# Altium project RpiRackHat.PrjPcb
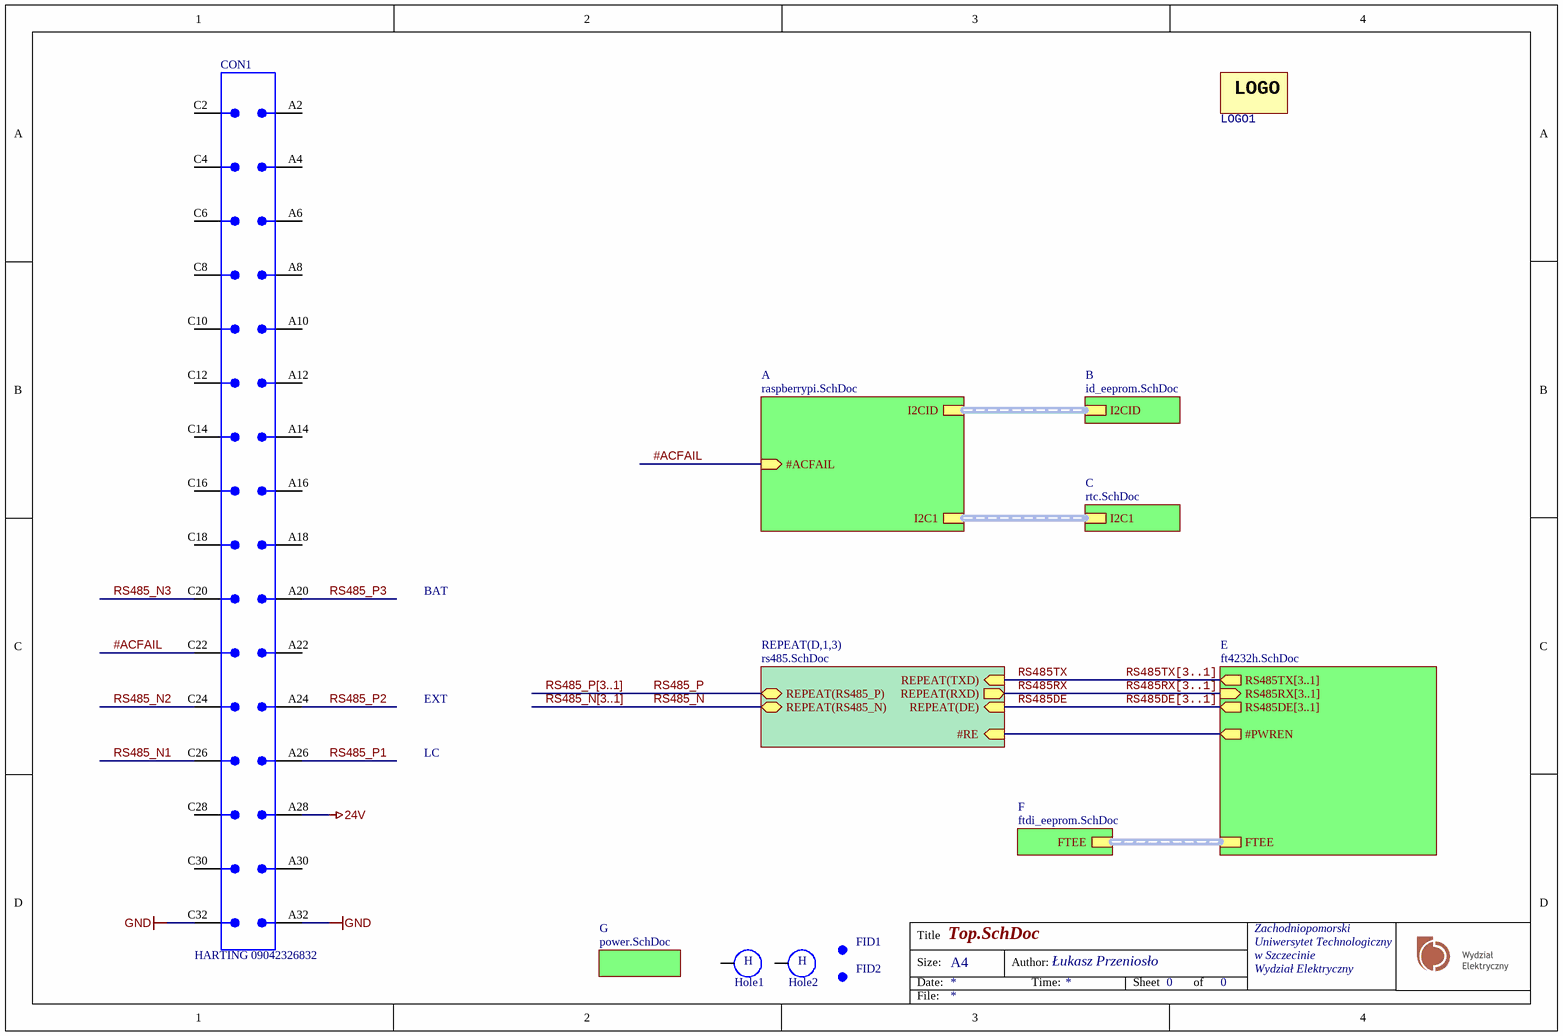
[diagram p0: Top.SchDoc]
id: RpiRackHat; ver: 1.0
8 sheets, 106 parts. Net scope: hierarchical (ports join the sheet entries above them; power ports are global).
Board file: RpiRackHat.PcbDoc
Sheets:
  Top.SchDoc
    E = ft4232h.SchDoc
    B = id_eeprom.SchDoc
    D1 = rs485.SchDoc
    D2 = rs485.SchDoc
    D3 = rs485.SchDoc
    C = rtc.SchDoc
    A = raspberrypi.SchDoc
    G = power.SchDoc
    F = ftdi_eeprom.SchDoc

## Sheet Top.SchDoc: Test
size A4; DrawnBy: Łukasz Przeniosło; Organization: Zachodniopomorski; Address1: Uniwersytet Technologiczny; Address2: w Szczecinie; Address3: Wydział Elektryczny; DocumentNumber: 1111; Revision: 1.0; SheetNumber: 0; SheetTotal: 0

### Parts
CON1  HARTING 09042326832  [HARTING 09041326921]
FID1  Fiducial  [Fid Round]  (value not drawn)  (no BOM)
FID2  Fiducial  [Fid Round]  (value not drawn)  (no BOM)
Hole1  Hole  [Hole-3/6]  (value not drawn)
Hole2  Hole  [Hole-3/6]  (value not drawn)
LOGO1  Logo  [LOGO_BEMKO]  (value not drawn)

### Sub-sheets
A = raspberrypi.SchDoc: I2CID (harness I2CID), I2C1 (harness I2C1), #ACFAIL (in)
B = id_eeprom.SchDoc: I2CID (harness I2CID)
C = rtc.SchDoc: I2C1 (harness I2C1)
E = ft4232h.SchDoc: #PWREN (out), FTEE (harness FTEE), RS485DE[3..1] (out), RS485RX[3..1] (in), RS485TX[3..1] (out)
F = ftdi_eeprom.SchDoc: FTEE (harness FTEE)
G = power.SchDoc: no entries
REPEAT(D,1,3) = rs485.SchDoc: REPEAT(TXD) (in), REPEAT(RXD) (out), REPEAT(DE) (in), #RE (in), REPEAT(RS485_N) (bidir), REPEAT(RS485_P) (bidir)

### Nets
24V: CON1.A28
GND: CON1.A32 CON1.C32
#ACFAIL: CON1.C22 ; sheet A/#ACFAIL
#PWREN: sheet E/#PWREN, sheet REPEAT(D,1,3)/#RE
RS485_N: sheet REPEAT(D,1,3)/REPEAT(RS485_N)
RS485_N1: CON1.C26
RS485_N2: CON1.C24
RS485_N3: CON1.C20
RS485_P: sheet REPEAT(D,1,3)/REPEAT(RS485_P)
RS485_P1: CON1.A26
RS485_P2: CON1.A24
RS485_P3: CON1.A20
RS485DE: sheet REPEAT(D,1,3)/REPEAT(DE)
RS485RX: sheet REPEAT(D,1,3)/REPEAT(RXD)
RS485TX: sheet REPEAT(D,1,3)/REPEAT(TXD)

Not connected (* = marked no-connect by the designer): CON1 A2 A4 A6 A8 A10 A12 A14 A16 A18 A22 A30 C2 C4 C6 C8 C10 C12 C14 C16 C18 C28 C30; Hole1 1; Hole2 1

### Buses and harness runs
bus RS485_N[3..1]
bus RS485_P[3..1]
bus RS485DE[3..1] = sheet E/RS485DE[3..1]
bus RS485RX[3..1] = sheet E/RS485RX[3..1]
bus RS485TX[3..1] = sheet E/RS485TX[3..1]
harness sheet A/I2C1 = sheet C/I2C1
harness sheet A/I2CID = sheet B/I2CID
harness sheet E/FTEE = sheet F/FTEE

### Notes on the sheet
- BAT
- EXT
- LC
- Title
- Size:
- Date:
- A4
- Author:
- Time:
- Sheet
- of
- File:
- (in symbol HOLE_) H
- (in symbol Logo) LOGO

### Library data of the parts
CON1 = HARTING_09042326832: Board-to-Board Connector, Eurocard VME, Vertical, 3-Row, 32-Position,
FID1 FID2 = FID ROUND: round fiducial
Hole1 Hole2 = HOLE_

## Sheet ft4232h.SchDoc: Test
size A4; DrawnBy: Łukasz Przeniosło; Organization: Zachodniopomorski; Address1: Uniwersytet Technologiczny; Address2: w Szczecinie; Address3: Wydział Elektryczny; DocumentNumber: 4; Revision: 1.0; SheetNumber: 4; SheetTotal: 8
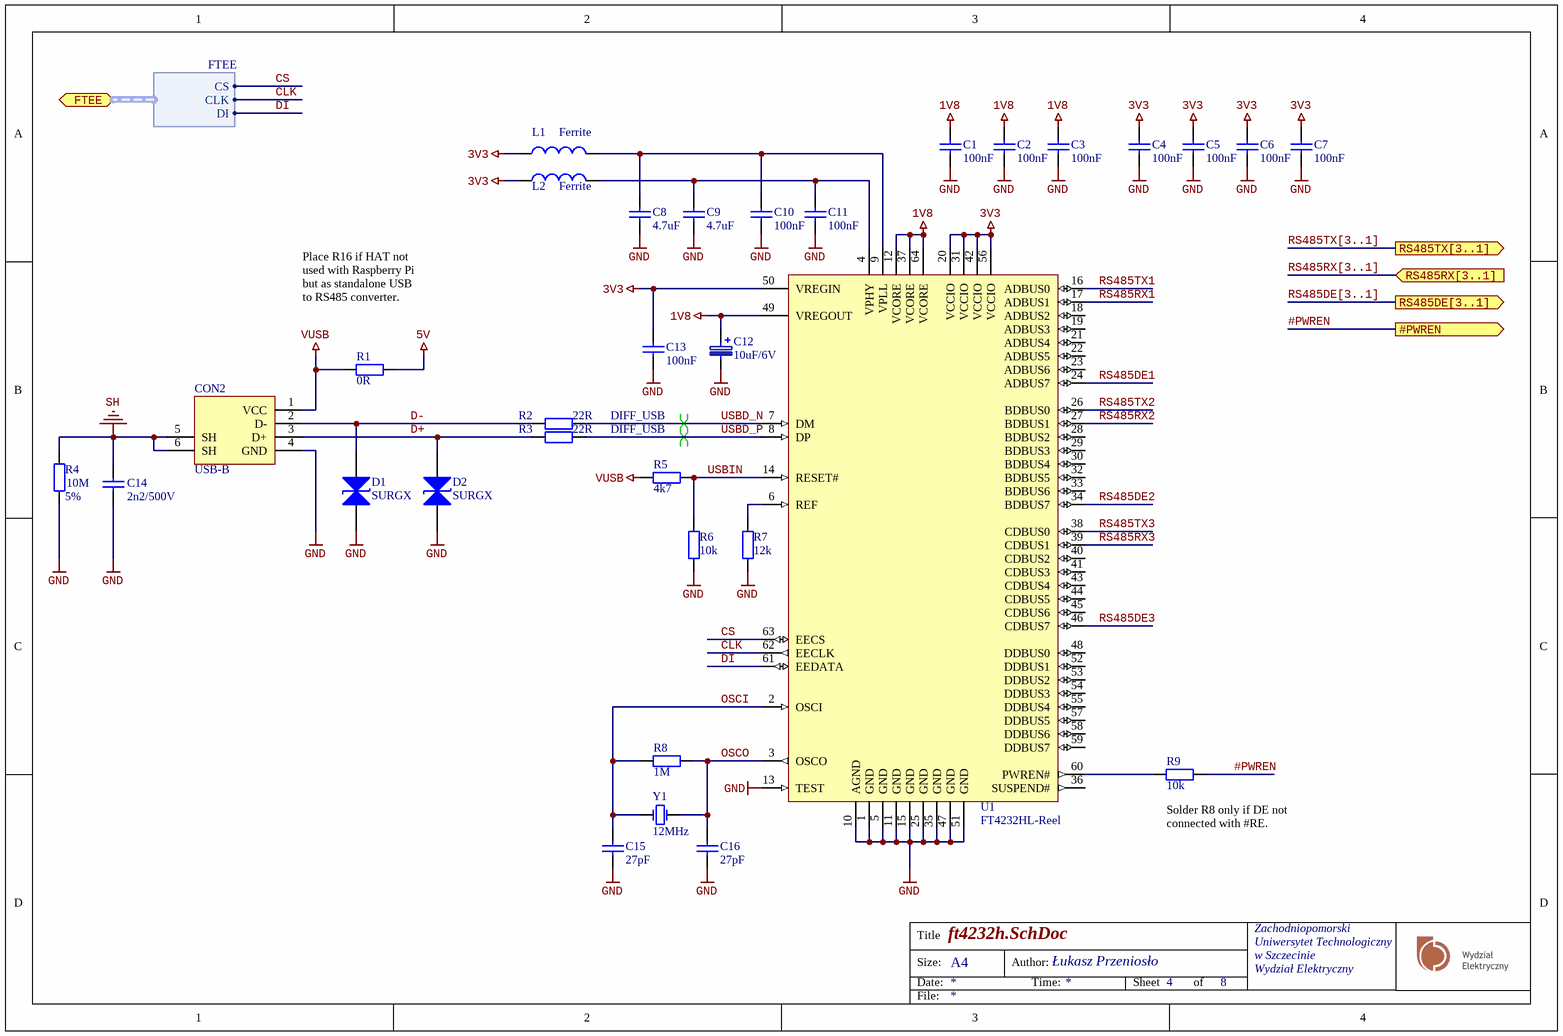
[diagram p1: ft4232h.SchDoc]

### Parts
C1  100nF  [CAPC1608N]
C2  100nF  [CAPC1608N]
C3  100nF  [CAPC1608N]
C4  100nF  [CAPC1608N]
C5  100nF  [CAPC1608N]
C6  100nF  [CAPC1608N]
C7  100nF  [CAPC1608N]
C8  4.7uF  [CAPC1608N]
C9  4.7uF  [CAPC1608N]
C10  100nF  [CAPC1608N]
C11  100nF  [CAPC1608N]
C12  10uF/6V  [SMDA]
C13  100nF  [CAPC1608N]
C14  2n2/500V  [CAPC3216N]
C15  27pF  [CAPC1608N]
C16  27pF  [CAPC1608N]
CON2  USB-B  [USB-B-STRAIGHT]
D1  SURGX  [SURGX-0603]
D2  SURGX  [SURGX-0603]
L1  Ferrite  [inductor_0603]
L2  Ferrite  [inductor_0603]
R1  0R  [RESC2012N]
R2  22R  [RESC1608N]
R3  22R  [RESC1608N]
R4  Tolerance: 5%  [RESC3216N]  (hidden comment: 10M)
R5  4k7  [RESC1608N]
R6  10k  [RESC1608N]
R7  12k  [RESC1608N]
R8  1M  [RESC1608N]
R9  10k  [RESC1608N]
U1  FT4232HL-Reel  [LQFP-64_L]
Y1  12MHz  [HC49/4H_SMX]

### Ports
#PWREN (out), FTEE (harness FTEE), RS485DE[3..1] (out), RS485RX[3..1] (in), RS485TX[3..1] (out)

### Harnesses
FTEE: CS, CLK, DI

### Nets
1V8: C1.1 C2.1 C3.1 C12.1 U1.12(VCORE) U1.37(VCORE) U1.49(VREGOUT) U1.64(VCORE)
3V3: C4.1 C5.1 C6.1 C7.1 C13.1 L1.1 L2.1 U1.20(VCCIO) U1.31(VCCIO) U1.42(VCCIO) U1.50(VREGIN) U1.56(VCCIO)
5V: R1.1
GND: C1.2 C2.2 C3.2 C4.2 C5.2 C6.2 C7.2 C8.2 C9.2 C10.2 C11.2 C12.2 C13.2 C14.1 C15.1 C16.1 CON2.4(GND) D1.1 D2.1 R4.1 R6.2 R7.2 U1.1(GND) U1.5(GND) U1.10(AGND) U1.11(GND) U1.13(TEST) U1.15(GND) U1.25(GND) U1.35(GND) U1.47(GND) U1.51(GND)
SH: C14.2 CON2.5(SH) CON2.6(SH) R4.2
VUSB: CON2.1(VCC) R1.2 R5.1
#PWREN: R9.1 ; port #PWREN
CLK: U1.62(EECLK) ; port FTEE.CLK
CS: U1.63(EECS) ; port FTEE.CS
D+: CON2.3(D+) D2.2 R3.1
D-: CON2.2(D-) D1.2 R2.1
DI: U1.61(EEDATA) ; port FTEE.DI
OSCI: C15.2 R8.2 U1.2(OSCI) Y1.1(OSC1)
OSCO: C16.2 R8.1 U1.3(OSCO) Y1.2(OSC2)
RS485DE1: U1.24(ADBUS7)
RS485DE2: U1.34(BDBUS7)
RS485DE3: U1.46(CDBUS7)
RS485RX1: U1.17(ADBUS1)
RS485RX2: U1.27(BDBUS1)
RS485RX3: U1.39(CDBUS1)
RS485TX1: U1.16(ADBUS0)
RS485TX2: U1.26(BDBUS0)
RS485TX3: U1.38(CDBUS0)
USBD_N: R2.2 U1.7(DM)
USBD_P: R3.2 U1.8(DP)
USBIN: R5.2 R6.1 U1.14(RESET#)
NetC8_1: C8.1 C10.1 L1.2 U1.9(VPLL)
NetC9_1: C9.1 C11.1 L2.2 U1.4(VPHY)
NetR7_1: R7.1 U1.6(REF)
NetR9_2: R9.2 U1.60(PWREN#)

Not connected (* = marked no-connect by the designer): U1 18(ADBUS2) 19(ADBUS3) 21(ADBUS4) 22(ADBUS5) 23(ADBUS6) 28(BDBUS2) 29(BDBUS3) 30(BDBUS4) 32(BDBUS5) 33(BDBUS6) 36(SUSPEND#) 40(CDBUS2) 41(CDBUS3) 43(CDBUS4) 44(CDBUS5) 45(CDBUS6) 48(DDBUS0) 52(DDBUS1) 53(DDBUS2) 54(DDBUS3) 55(DDBUS4) 57(DDBUS5) 58(DDBUS6) 59(DDBUS7)

### Buses and harness runs
bus RS485DE[3..1] = port RS485DE[3..1]
bus RS485RX[3..1] = port RS485RX[3..1]
bus RS485TX[3..1] = port RS485TX[3..1]

### Layout directives
differential pair; net class DIFF_USB: USBD_N, USBD_P

### Notes on the sheet
- Place R16 if HAT not used with Raspberry Pi but as standalone USB to RS485 converter.
- (near R9) Solder R8 only if DE not connected with #RE.
- Title
- Size:
- Date:
- A4
- Author:
- Time:
- Sheet
- of
- File:

### Library data of the parts
C1-C11 C13-C16 = Capacitor
  C1-C7 C10 C11 C13: Value: 100nF
  C8 C9: Value: 4.7uF
  C14: Value: 2n2/500V
  C15 C16: Value: 27pF
C12 = 100uF 6.3V-SMDB: Polarized Capacitor (Surface Mount); Value: 10uF; PackageReference: SMDB; Manufacturer: *; Manufacturer Part No.: *; Distributor: tme.pl; Distributor Order Code: TC 100/6.3-SMDB; tme.pl: TC 100/6.3-SMDA; farnell: 1135048
D1 D2 = SURGX: ESD Suppressor; ComponentLink1Description: Manufacturer Link; ComponentLink2Description: Datasheet; Distributor: tme.pl
L1 L2 = Inductor: Code_IEC: 1005; Value: 10mH; Published: 8-Jun-2000; LatestRevisionDate: 29-May-2009; LatestRevisionNote: IPC-7351 Footprint Added.; PackageReference: 0402-A; Publisher: Altium Limited; PackageDescription: Chip Inductor; Code_JEITA: 0402
R1-R3 = Resistor: Tolerance: 5%; Power: 0W
  R1: Value: 0R
  R2 R3: Value: 22R
R4 = Resistor: Power: 0W; Value: 10M
R5-R7 = Resistor: Tolerance: 1%; Power: 0W
  R5: Value: 4k7
  R6: Value: 10k
  R7: Value: 12k
R8 R9 = Resistor: Power: 0W; Tolerance: 5%
  R8: Value: 1M
  R9: Value: 10k
U1 = COM-UART-FT4232H-LQFP64: Quad High Speed USB To Multipurpose UART/MPSSE IC, 64-pin LQFP, Tape and Reel; Manufacturer: FTDI; PackageDescription: 64-Pin Thin Quad Flat Pack, 10 x 10 x 1.4 mm Body, 0.5 mm Pitch; DatasheetVersion: ver 2.2, Jan-2012; ComponentLink2URL: http://www.ftdichip.com/Support/Documents/DataSheets/ICs/DS_FT4232H.pdf; ComponentLink1Description: Manufacturer URL; PackageReference: LQFP-64; PackageVersion: Jan-12; RevisionNote: DatasheetVersion updated to 2.2 Jan-2012; PartNumber: FT4232HL-Reel; ComponentLink1URL: http://www.ftdichip.com/; ComponentLink2Description: Datasheet
Y1 = HC49: Value: 12MHz

## Sheet id_eeprom.SchDoc: Test
size A4; DrawnBy: Łukasz Przeniosło; Organization: Zachodniopomorski; Address1: Uniwersytet Technologiczny; Address2: w Szczecinie; Address3: Wydział Elektryczny; DocumentNumber: 3; Revision: 1.0; SheetNumber: 3; SheetTotal: 8
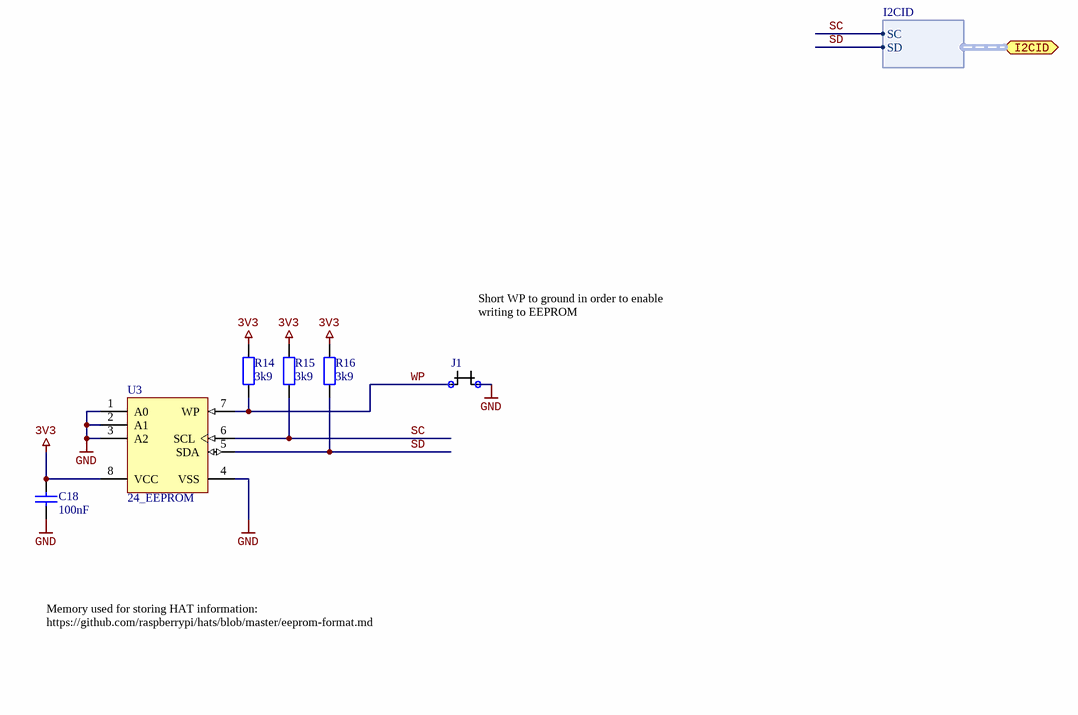
[diagram p2: id_eeprom.SchDoc]

### Parts
C18  100nF  [CAPC1608N]
J1  Jumper  [JUMPER]  (value not drawn)
R14  3k9  [RESC1608N]
R15  3k9  [RESC1608N]
R16  3k9  [RESC1608N]
U3  24_EEPROM  [SO-8_L]

### Ports
I2CID (harness I2CID)

### Harnesses
I2CID: SC, SD

### Nets
3V3: C18.2 R14.1 R15.1 R16.1 U3.8(VCC)
GND: C18.1 J1.2 U3.1(A0) U3.2(A1) U3.3(A2) U3.4(VSS)
SC: R15.2 U3.6(SCL) ; port I2CID.SC
SD: R16.2 U3.5(SDA) ; port I2CID.SD
WP: J1.1 R14.2 U3.7(WP)

### Notes on the sheet
- (near J1) Short WP to ground in order to enable writing to EEPROM
- Memory used for storing HAT information:
  https://github.com/raspberrypi/hats/blob/master/eeprom-format.md
- Title
- Size:
- Date:
- A4
- Author:
- Time:
- Sheet
- of
- File:

### Library data of the parts
C18 = Capacitor: Value: 100nF
R14-R16 = Resistor: Tolerance: 5%; Power: 0W; Value: 3k9
U3 = 24_EEPROM: 16Kbit, 400kHz, 2.5V, I2C Serial EEPROM, 8-Pin SOIC 150mil, Extended Temperature; DatasheetVersion: revA, Nov-2008; Code_JEDEC: MS-012; PackageDescription: 8-Lead Plastic Small Outline (SN) - Narrow, 3.90mm Body [SOIC]; Code_IPC: SOIC127P600-8; PackageReference: SOIC-SN8; PackageVersion: revBB, Aug-2009

## Sheet rs485.SchDoc: Test
size A4; DrawnBy: Łukasz Przeniosło; Organization: Zachodniopomorski; Address1: Uniwersytet Technologiczny; Address2: w Szczecinie; Address3: Wydział Elektryczny; DocumentNumber: 6; Revision: 1.0; SheetNumber: 6; SheetTotal: 8
Used 3 times, as channels D1, D2, D3. Parts and nets are listed once, with the designators drawn on the sheet.
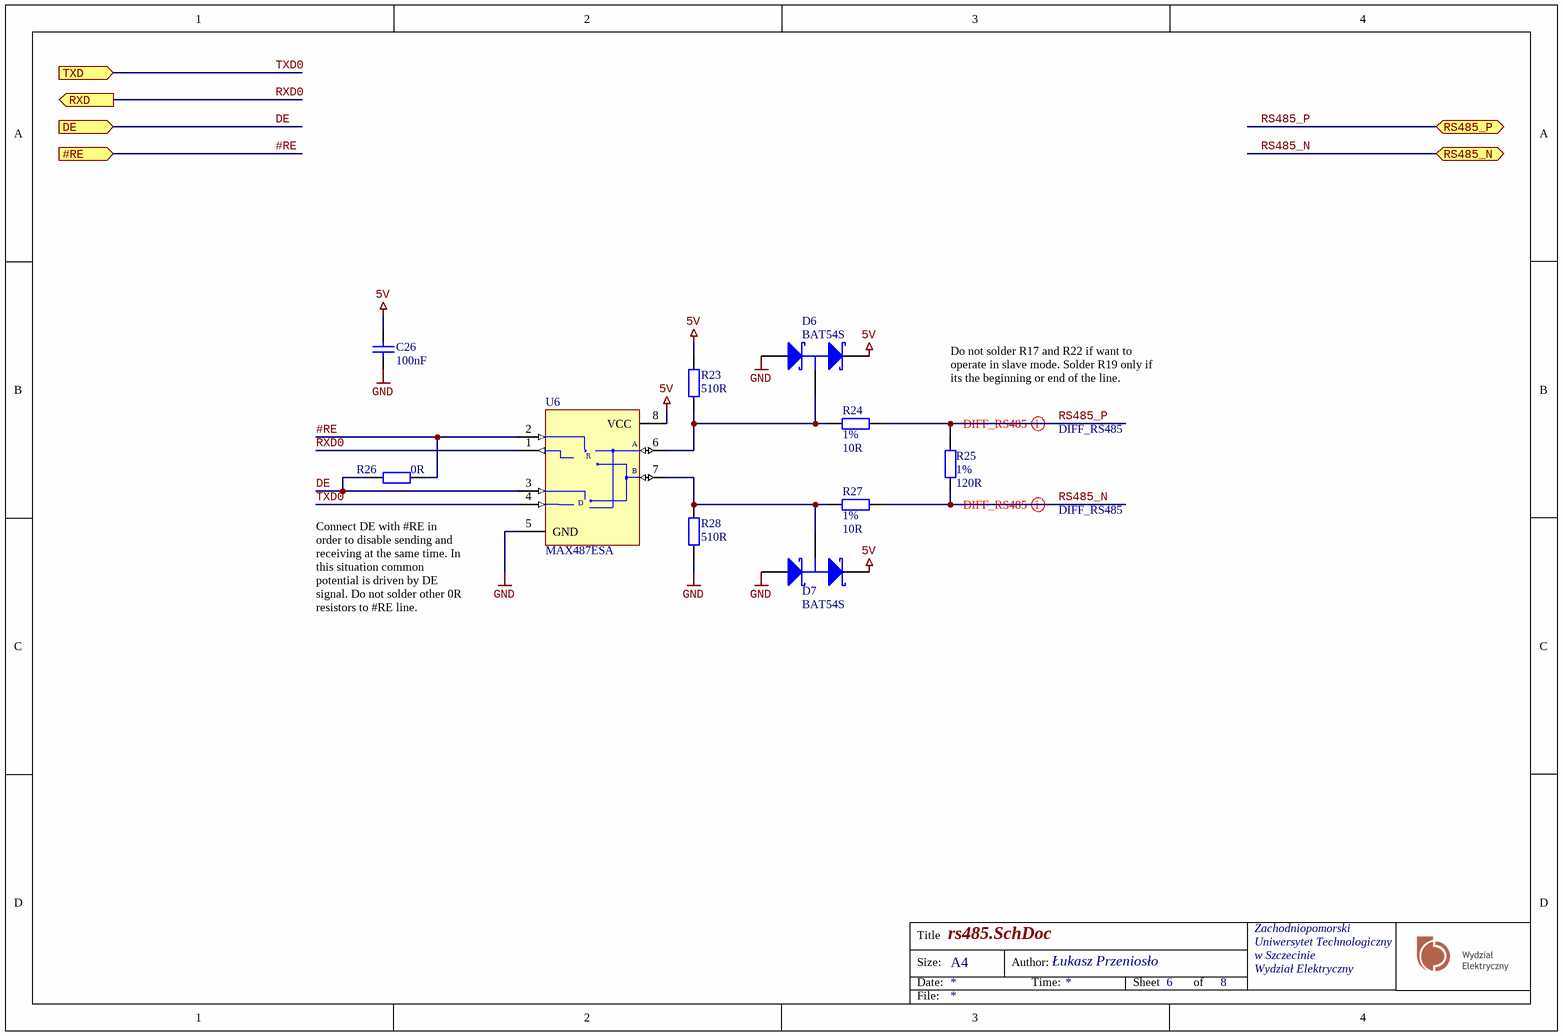
[diagram p3: rs485.SchDoc]

### Parts
C26  100nF  [CAPC1608N]
D6  BAT54S  [SOT23-3L]
D7  BAT54S  [SOT23-3L]
R23  510R  [RESC1608N]
R24  Tolerance: 1%  [RESC2012N]  (hidden comment: 10R)
R25  Tolerance: 1%  [RESC3216N]  (hidden comment: 120R)
R26  0R  [RESC1005N]
R27  Tolerance: 1%  [RESC2012N]  (hidden comment: 10R)
R28  510R  [RESC1608N]
U6  MAX487ESA  [SO-8_L]

### Ports
#RE (in), DE (in), RS485_N (bidir), RS485_P (bidir), RXD (out), TXD (in)

### Nets
5V: C26.1 D6.2(K) D7.2(K) R23.2 U6.8(VCC)
GND: C26.2 D6.1(A) D7.1(A) R28.1 U6.5(GND)
#RE: R26.2 U6.2(~{RE}) ; port #RE
DE: R26.1 U6.3(DE) ; port DE
RS485_N: R25.2 R27.1 ; port RS485_N
RS485_P: R24.1 R25.1 ; port RS485_P
RXD0: U6.1(RO) ; port RXD
TXD0: U6.4(DI) ; port TXD
NetD6_3: D6.3(C) R23.1 R24.2 U6.6(A)
NetD7_3: D7.3(C) R27.2 R28.2 U6.7(B)

### Channels
D1: designators end in D1; ports #RE=#PWREN DE=RS485DE1 RS485_N=RS485_N1 RS485_P=RS485_P1 RXD=RS485RX1 TXD=RS485TX1
D2: designators end in D2; ports #RE=#PWREN DE=RS485DE2 RS485_N=RS485_N2 RS485_P=RS485_P2 RXD=RS485RX2 TXD=RS485TX2
D3: designators end in D3; ports #RE=#PWREN DE=RS485DE3 RS485_N=RS485_N3 RS485_P=RS485_P3 RXD=RS485RX3 TXD=RS485TX3

### Layout directives
differential pair; net class DIFF_RS485: RS485_N1, RS485_P1

### Notes on the sheet
- Do not solder R17 and R22 if want to operate in slave mode. Solder R19 only if its the beginning or end of the line.
- (near R26) Connect DE with #RE in order to disable sending and receiving at the same time. In this situation common potential is driven by DE signal. Do not solder other 0R resistors to #RE line.
- Title
- Size:
- Date:
- A4
- Author:
- Time:
- Sheet
- of
- File:
- (in symbol MAX487ESA) R; D

### Library data of the parts
C26 = Capacitor: Value: 100nF
D6 D7 = BAT54S: Schottky Barrier Double Diode; Published: 17-Sep-2003; DatasheetVersion: 4-Mar-2002; PackageVersion: May-1999; PackageReference: SOT23; Publisher: Altium Limited; PackageDescription: 3-Pin SOT-23 Package 0.95 mm Pitch, 2.3 mm Lead Span; ComponentLink1Description: Manufacturer Link; ComponentLink1URL: http://www.semiconductors.philips.com/; ComponentLink2Description: Datasheet; ComponentLink2URL: http://www.semiconductors.philips.com/acrobat/datasheets/BAT54_SERIES_4.pdf; LatestRevisionDate: 12-Dec-2006; LatestRevisionNote: IPC-7351 Footprint Added.
R23 R28 = Resistor: Tolerance: 5%; Power: 0W; Value: 510R
R24 R25 R27 = Resistor: Power: 0W
  R24 R27: Value: 10R
  R25: Value: 120R
R26 = Resistor: Power: 0W; Tolerance: 1%; Value: 0R
U6 = MAX487ESA: Low-Power, Slew-Rate-Limited RS-485/RS-422 Transceiver; Published: 16-Jan-2001; LatestRevisionDate: 13-Apr-2006; LatestRevisionNote: IPC-7351 Footprint Added.; DatasheetVersion: Feb-1996; PackageReference: NSO8; Publisher: Altium Limited; PackageDescription: 8-Pin Small Outline Integrated Circuit 1.27 mm Pitch; Code_JEDEC: MS-012-AA; Code_IPC: SOIC127P600-8; ComponentLink1Description: Manufacturer Link; ComponentLink1URL: http://www.maxim-ic.com/; ComponentLink2Description: Datasheet; ComponentLink2URL: http://pdfserv.maxim-ic.com/en/ds/MAX1487-MAX491.pdf

## Sheet rtc.SchDoc: Test
size A4; DrawnBy: Łukasz Przeniosło; Organization: Zachodniopomorski; Address1: Uniwersytet Technologiczny; Address2: w Szczecinie; Address3: Wydział Elektryczny; DocumentNumber: 5; Revision: 1.0; SheetNumber: 5; SheetTotal: 8
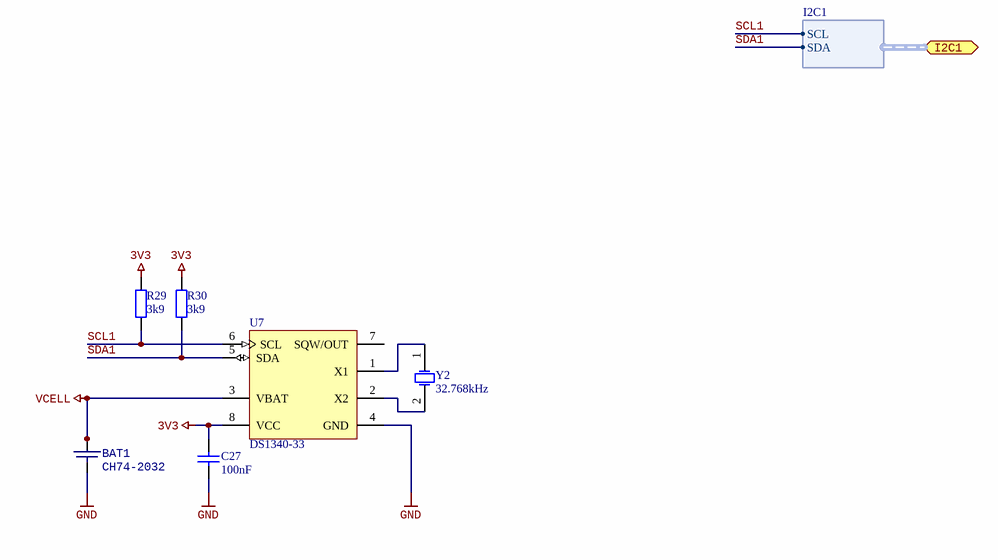
[diagram p4: rtc.SchDoc]

### Parts
BAT1  CH74-2032  [BAT_2032_HOLDER]
C27  100nF  [CAPC1608N]
R29  3k9  [RESC1608N]
R30  3k9  [RESC1608N]
U7  DS1340-33  [SO-8_L]
Y2  32.768kHz  [ABS25-crystal]

### Ports
I2C1 (harness I2C1)

### Harnesses
I2C1: SCL, SDA

### Nets
3V3: C27.2 R29.1 R30.1 U7.8(VCC)
GND: BAT1.3(BAT-) C27.1 U7.4(GND)
VCELL: BAT1.1(BAT+) BAT1.2(BAT+) U7.3(VBAT)
SCL1: R29.2 U7.6(SCL) ; port I2C1.SCL
SDA1: R30.2 U7.5(SDA) ; port I2C1.SDA
NetU7_1: U7.1(X1) Y2.1(OSC1)
NetU7_2: U7.2(X2) Y2.2(OSC2)

Not connected (* = marked no-connect by the designer): U7 7(SQW/OUT)

### Notes on the sheet
- Title
- Size:
- Date:
- A4
- Author:
- Time:
- Sheet
- of
- File:

### Library data of the parts
C27 = Capacitor: Value: 100nF
R29 R30 = Resistor: Tolerance: 5%; Power: 0W; Value: 3k9
U7 = CMP-0254-00324-1: 64 x 8, Serial, I2C Real-Time Clock, 5.0V, 8-Pin SO, -40 to 85 degC, Pb-Free; PackageDescription: 8-Pin Small-Outline IC, Narrow (0.15in), 1.27 mm Pitch, SOIC (N), Pb-Free; PackageVersion: revC, 2010; ComponentLink3URL: http://pdfserv.maxim-ic.com/package_dwgs/21-0041.PDF; Code_IPC: SOIC127P600-8; Code_JEDEC: MS-012-AA; ComponentLink2Description: Datasheet; ComponentLink3Description: Package Specification; PackageReference: S8+2; DatasheetVersion: 10-Feb-2008; ComponentLink2URL: http://datasheets.maxim-ic.com/en/ds/DS1307.pdf; ComponentLink1Description: Manufacturer URL; ComponentLink1URL: http://www.maxim-ic.com
Y2 = XTAL: Crystal Oscillator; Value: 32.768kHz

## Sheet raspberrypi.SchDoc: Test
size A4; DrawnBy: Łukasz Przeniosło; Organization: Zachodniopomorski; Address1: Uniwersytet Technologiczny; Address2: w Szczecinie; Address3: Wydział Elektryczny; DocumentNumber: 2; Revision: 1.0; SheetNumber: 2; SheetTotal: 8
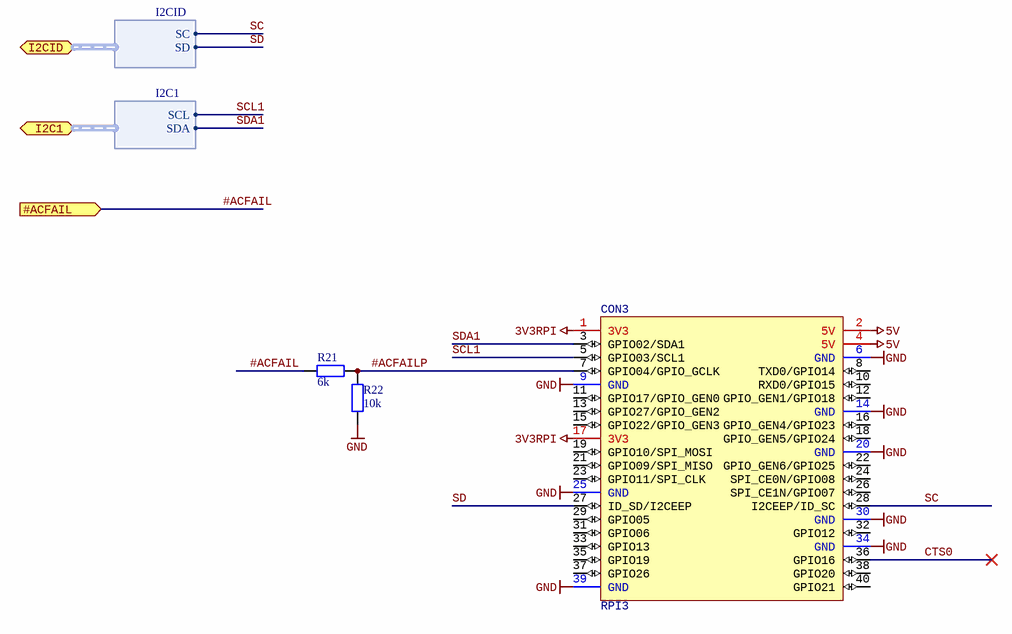
[diagram p5: raspberrypi.SchDoc]

### Parts
CON3  RPI3  [RaspberryPi3_CON]
R21  6k  [RESC1608N]
R22  10k  [RESC1608N]

### Ports
#ACFAIL (in), I2C1 (harness I2C1), I2CID (harness I2CID)

### Harnesses
I2CID: SC, SD
I2C1: SCL, SDA

### Nets
3V3RPI: CON3.1(3V3) CON3.17(3V3)
5V: CON3.2(5V) CON3.4(5V)
GND: CON3.6(GND) CON3.9(GND) CON3.14(GND) CON3.20(GND) CON3.25(GND) CON3.30(GND) CON3.34(GND) CON3.39(GND) R22.1
#ACFAIL: R21.2 ; port #ACFAIL
#ACFAILP: CON3.7(GPIO04/GPIO_GCLK) R21.1 R22.2
CTS0: CON3.36(GPIO16)
SC: CON3.28(I2CEEP/ID_SC) ; port I2CID.SC
SCL1: CON3.5(GPIO03/SCL1) ; port I2C1.SCL
SD: CON3.27(ID_SD/I2CEEP) ; port I2CID.SD
SDA1: CON3.3(GPIO02/SDA1) ; port I2C1.SDA

Not connected (* = marked no-connect by the designer): CON3 8(TXD0/GPIO14) 10(RXD0/GPIO15) 11(GPIO17/GPIO_GEN0) 12(GPIO_GEN1/GPIO18) 13(GPIO27/GPIO_GEN2) 15(GPIO22/GPIO_GEN3) 16(GPIO_GEN4/GPIO23) 18(GPIO_GEN5/GPIO24) 19(GPIO10/SPI_MOSI) 21(GPIO09/SPI_MISO) 22(GPIO_GEN6/GPIO25) 23(GPIO11/SPI_CLK) 24(SPI_CE0N/GPIO08) 26(SPI_CE1N/GPIO07) 29(GPIO05) 31(GPIO06) 32(GPIO12) 33(GPIO13) 35(GPIO19) 37(GPIO26) 38(GPIO20) 40(GPIO21)

### Notes on the sheet
- Title
- Size:
- Date:
- A4
- Author:
- Time:
- Sheet
- of
- File:

### Library data of the parts
CON3 = RaspberryPiCon: Raspberry pi model 3B connector with step
R21 R22 = Resistor: Tolerance: 5%; Power: 0W
  R21: Value: 6k
  R22: Value: 10k

## Sheet power.SchDoc: Test
size A4; DrawnBy: Łukasz Przeniosło; Organization: Zachodniopomorski; Address1: Uniwersytet Technologiczny; Address2: w Szczecinie; Address3: Wydział Elektryczny; DocumentNumber: 8; Revision: 1.0; SheetNumber: 8; SheetTotal: 8
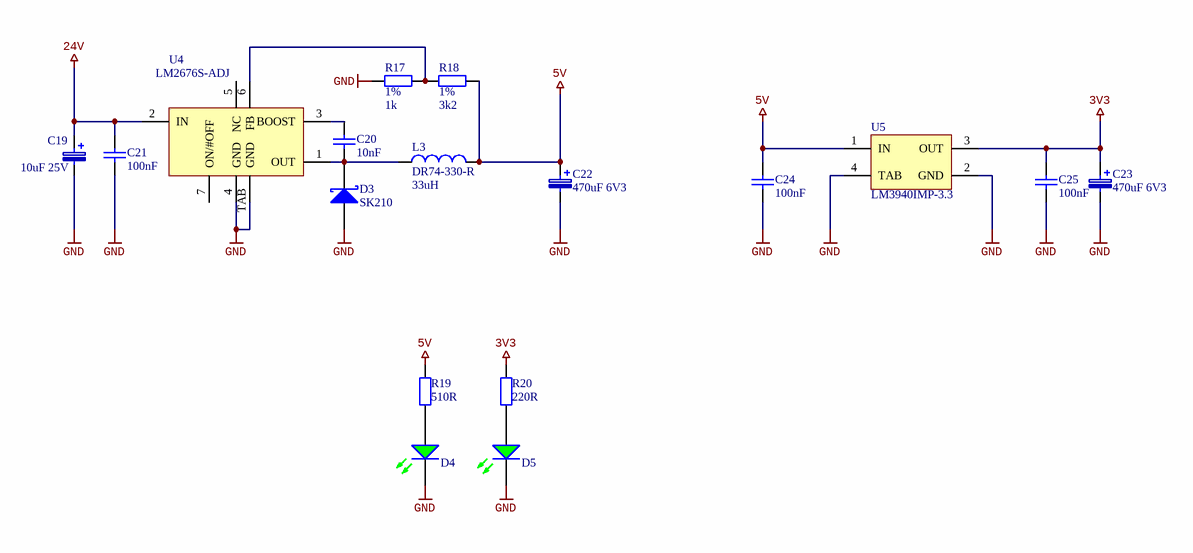
[diagram p6: power.SchDoc]

### Parts
C19  10uF 25V  [SMDB]
C20  10nF  [CAPC1608N]
C21  100nF  [CAPC1608N]
C22  470uF 6V3  [SMDD]
C23  470uF 6V3  [SMDD]
C24  100nF  [CAPC1608N]
C25  100nF  [CAPC1608N]
D3  SK210  [SMB]
D4  LL-S172GC-2A  [CD2012-0805]  (value not drawn)
D5  LL-S172GC-2A  [CD2012-0805]  (value not drawn)
L3  DR74-330-R  value 33uH  [DR74 Series]
R17  Tolerance: 1%  [RESC1608N]  (hidden comment: 1k)
R18  Tolerance: 1%  [RESC1608N]  (hidden comment: 3k2)
R19  510R  [RESC1608N]
R20  220R  [RESC1608N]
U4  LM2676S-ADJ  [TO-263-7]
U5  LM3940IMP-3.3  [MP04A_N]

### Nets
3V3: C23.1 C25.2 R20.1 U5.3(OUT)
5V: C22.1 C24.2 L3.2 R18.2 R19.1 U5.1(IN)
24V: C19.1 C21.2 U4.2(IN)
GND: C19.2 C21.1 C22.2 C23.2 C24.1 C25.1 D3.1(A) D4.2(K) D5.2(K) R17.1 U4.4(GND) U4.TAB(GND) U5.2(GND) U5.4(TAB)
NetC20_1: C20.1 D3.2(K) L3.1 U4.1(OUT)
NetC20_2: C20.2 U4.3(BOOST)
NetD4_1: D4.1(A) R19.2
NetD5_1: D5.1(A) R20.2
NetR17_2: R17.2 R18.1 U4.6(FB)

Not connected (* = marked no-connect by the designer): U4 5(NC) 7(ON/#OFF)

### Notes on the sheet
- Title
- Size:
- Date:
- A4
- Author:
- Time:
- Sheet
- of
- File:

### Library data of the parts
C19 = Capacitor Tantalum: Value: 10uF 25V
C20 C21 = Capacitor
  C20: Value: 10nF
  C21: Value: 100nF
C22 C23 = 10uF 35V-SMDD: Polarized Capacitor (Surface Mount); Value: 10uF; PackageReference: SMDD; Manufacturer: *; Manufacturer Part No.: *; Distributor: tme.pl; Distributor Order Code: TC 10/35-SMDD; tme.pl: TC 10/35-SMDD
C24 C25 = Cap: Capacitor; Published: 8-Jun-2000; LatestRevisionDate: 17-Jul-2002; LatestRevisionNote: Re-released for DXP Platform.; Publisher: Altium Limited
D3 = MBRS340T3: Schottky Barrier Rectifier,  40V, 3A; PackageReference: SMC; Distributor: *; Distributor Order Code: *; Manufacturer Part No.: *; tme.pl: MBRS340T3
D4 D5 = Led Green: Typical GREEN LED; Manufacturer: Lucky Light; Value: LL-S172GC-2A
L3 = DR74-330-R: elfa.se: 58-101-14; Published: 8-Jun-2000; PackageDocument: Sep-1998; Publisher: Altium Limited; ComponentLink1Description: Manufacturer Link; ComponentLink2Description: Datasheet; Distributor: tme.pl
R17 R18 = Resistor: Power: 0W
  R17: Value: 1k
  R18: Value: 3k2
R19 R20 = Resistor: Tolerance: 5%; Power: 0W
  R19: Value: 510R
  R20: Value: 220R
U4 = LM2676S-ADJ: SIMPLE SWITCHER High Efficiency 3A Step-Down Voltage Regulator; elfa.se: 73-068-81; ComponentLink1Description: Manufacturer Link; ComponentLink1URL: http://www.national.com/; ComponentLink2Description: Datasheet; ComponentLink2URL: http://www.national.com/ds.cgi/LM/LM2676.pdf; Distributor: tme.pl
U5 = LM3940IMP-3.3: 1A Low Dropout Regulator for 5V to 3.3V Conversion, 4-pin SOT-223; Manufacturer: National Semiconductor; PackageTopMarking: XYTT*L52B; PowerWise: N; CompType: LDO IC; Published: 4-Dec-2008; DatasheetVersion: Jul-2007; PackageVersion: revB, Apr-2003; PackageReference: MP04A; Publisher: Altium Limited; PackageDescription: Molded SOT-223, 6.50 x 3.56 x 1.6mm Body, 4 Lead, 2.3mm Pitch; Supplier 1: Farnell; Supplier Part Number 1: 9779280; PartNumber: LM3940IMP-3.3; RoHS: N; PinCount: 4; Code_JEDEC: TO-261-AA; Code_IPC: SOT223-4; ComponentLink1Description: LM3940 Datasheet; ComponentLink1URL: http://www.national.com/ds/LM/LM3940.pdf; ComponentLink2Description: LM3940 Web Page; ComponentLink2URL: http://www.national.com/pf/LM/LM3940.html; ComponentLink3Description: MP04A Package Page; ComponentLink3URL: http://www.national.com/packaging/folders/mp04a.html

## Sheet ftdi_eeprom.SchDoc: Test
size A4; DrawnBy: Łukasz Przeniosło; Organization: Zachodniopomorski; Address1: Uniwersytet Technologiczny; Address2: w Szczecinie; Address3: Wydział Elektryczny; DocumentNumber: 7; Revision: 1.0; SheetNumber: 7; SheetTotal: 8
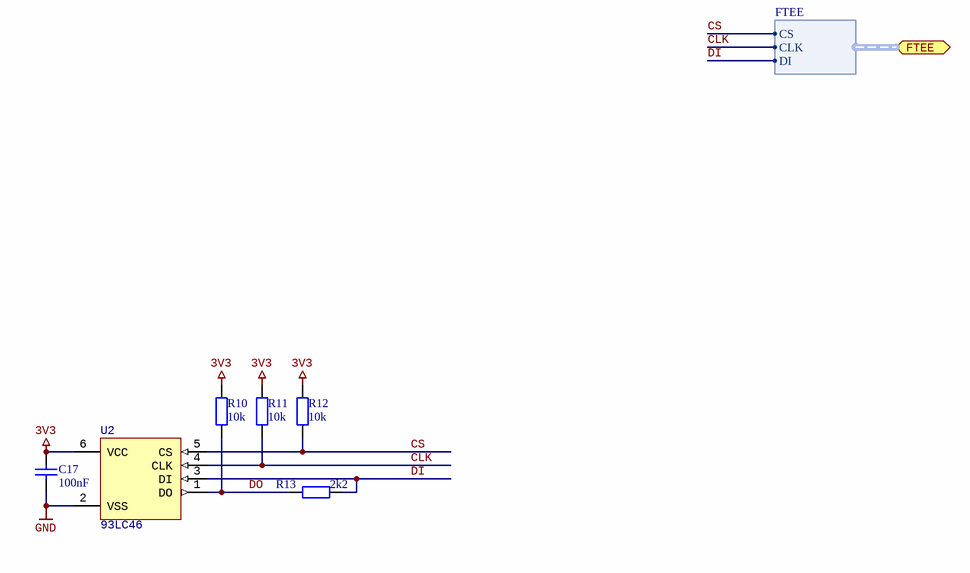
[diagram p7: ftdi_eeprom.SchDoc]

### Parts
C17  100nF  [CAPC1608N]
R10  10k  [RESC1608N]
R11  10k  [RESC1608N]
R12  10k  [RESC1608N]
R13  2k2  [RESC1608N]
U2  93LC46  [SOT23-6]

### Ports
FTEE (harness FTEE)

### Harnesses
FTEE: CS, CLK, DI

### Nets
3V3: C17.2 R10.1 R11.1 R12.1 U2.6(VCC)
GND: C17.1 U2.2(VSS)
CLK: R11.2 U2.4(CLK) ; port FTEE.CLK
CS: R12.2 U2.5(CS) ; port FTEE.CS
DI: R13.2 U2.3(DI) ; port FTEE.DI
DO: R10.2 R13.1 U2.1(DO)

### Notes on the sheet
- Title
- Size:
- Date:
- A4
- Author:
- Time:
- Sheet
- of
- File:

### Library data of the parts
C17 = Capacitor: Value: 100nF
R10-R13 = Resistor: Tolerance: 1%; Power: 0W
  R10-R12: Value: 10k
  R13: Value: 2k2
U2 = 93LC46: 1K Microwire Compatible Serial EEPROM

## Nets that join several sheets
3V3: ft4232h (12 pins), id_eeprom (5 pins), rtc (C27.2 R29.1 R30.1 U7.8), power (C23.1 C25.2 R20.1 U5.3), ftdi_eeprom (5 pins)
5V: ft4232h (R1.1), D1 (5 pins), D2 (5 pins), D3 (5 pins), raspberrypi (CON3.2 CON3.4), power (6 pins)
24V: Top (CON1.A28), power (C19.1 C21.2 U4.2)
GND: Top (CON1.A32 CON1.C32), ft4232h (32 pins), id_eeprom (6 pins), D1 (5 pins), D2 (5 pins), D3 (5 pins), rtc (BAT1.3 C27.1 U7.4), raspberrypi (9 pins), power (14 pins), ftdi_eeprom (C17.1 U2.2)
#ACFAIL: Top (CON1.C22), raspberrypi (R21.2)
#PWREN: ft4232h (R9.1), D1 (R26D1.2 U6D1.2), D2 (R26D2.2 U6D2.2), D3 (R26D3.2 U6D3.2)
CLK: ft4232h (U1.62), ftdi_eeprom (R11.2 U2.4)
CS: ft4232h (U1.63), ftdi_eeprom (R12.2 U2.5)
DI: ft4232h (U1.61), ftdi_eeprom (R13.2 U2.3)
RS485_N1: Top (CON1.C26), D1 (R25D1.2 R27D1.1)
RS485_N2: Top (CON1.C24), D2 (R25D2.2 R27D2.1)
RS485_N3: Top (CON1.C20), D3 (R25D3.2 R27D3.1)
RS485_P1: Top (CON1.A26), D1 (R24D1.1 R25D1.1)
RS485_P2: Top (CON1.A24), D2 (R24D2.1 R25D2.1)
RS485_P3: Top (CON1.A20), D3 (R24D3.1 R25D3.1)
RS485DE1: ft4232h (U1.24), D1 (R26D1.1 U6D1.3)
RS485DE2: ft4232h (U1.34), D2 (R26D2.1 U6D2.3)
RS485DE3: ft4232h (U1.46), D3 (R26D3.1 U6D3.3)
RS485RX1: ft4232h (U1.17), D1 (U6D1.1)
RS485RX2: ft4232h (U1.27), D2 (U6D2.1)
RS485RX3: ft4232h (U1.39), D3 (U6D3.1)
RS485TX1: ft4232h (U1.16), D1 (U6D1.4)
RS485TX2: ft4232h (U1.26), D2 (U6D2.4)
RS485TX3: ft4232h (U1.38), D3 (U6D3.4)
SC: id_eeprom (R15.2 U3.6), raspberrypi (CON3.28)
SCL1: rtc (R29.2 U7.6), raspberrypi (CON3.5)
SD: id_eeprom (R16.2 U3.5), raspberrypi (CON3.27)
SDA1: rtc (R30.2 U7.5), raspberrypi (CON3.3)